# EAGLE design Cthulhu_Shield_Rev2f (EAGLE 9.2.2)
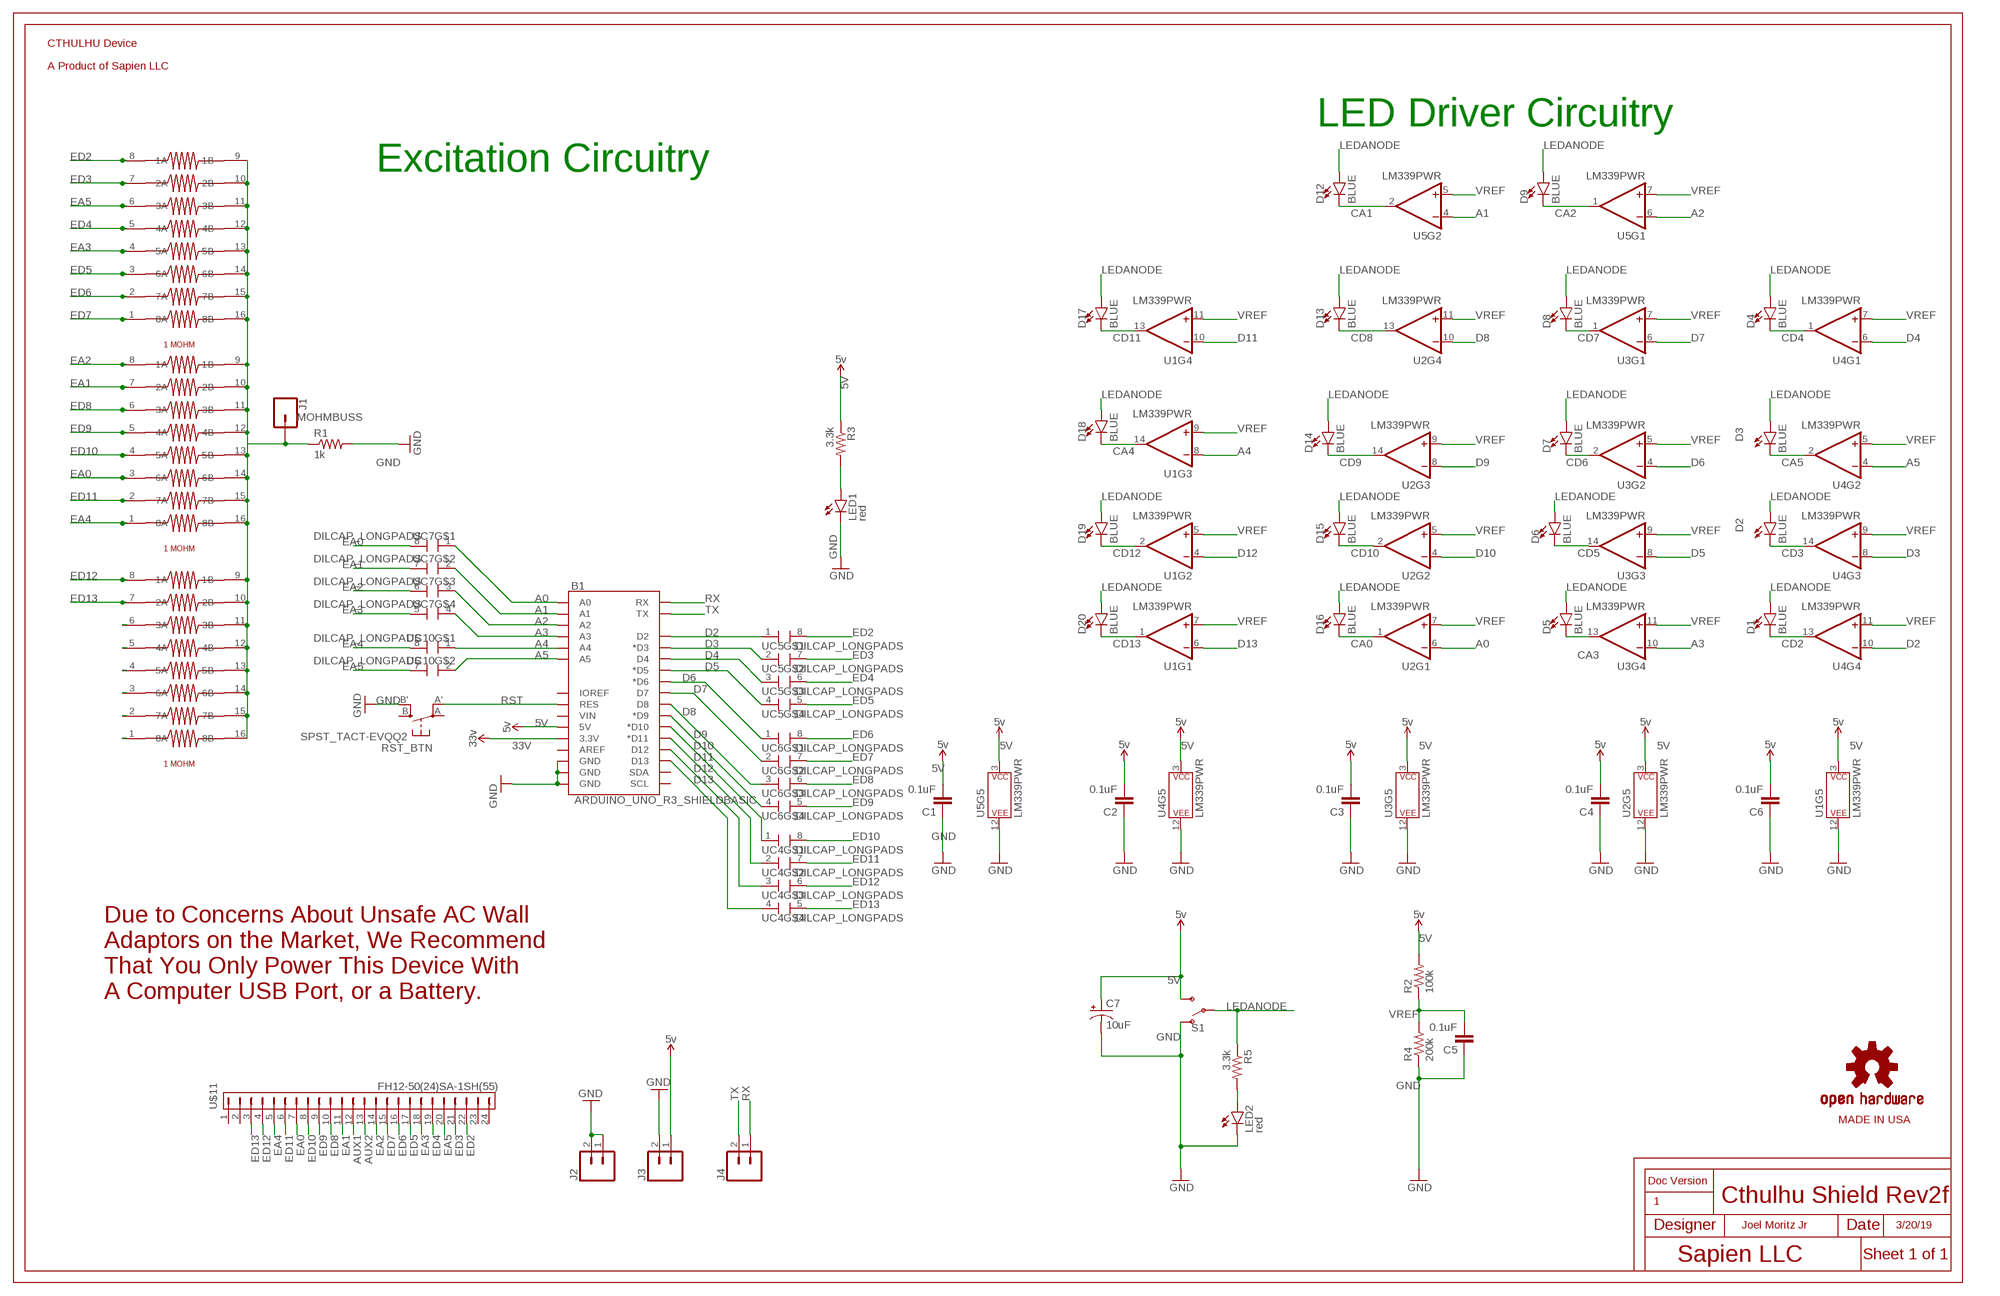
[diagram p0: schematic, sheet 1]

## Parts
B1  ARDUINO_UNO_R3_SHIELDBASIC  [UNO_R3_SHIELD]
C1  0.1uF  0.1UF-0603-25V-(+80/-20%)  [0603]
C2  0.1uF  0.1UF-0603-25V-(+80/-20%)  [0603]
C3  0.1uF  0.1UF-0603-25V-(+80/-20%)  [0603]
C4  0.1uF  0.1UF-0603-25V-(+80/-20%)  [0603]
C5  0.1uF  0.1UF-0603-25V-(+80/-20%)  [0603]
C6  0.1uF  0.1UF-0603-25V-(+80/-20%)  [0603]
C7  10uF  10UF-POLAR-EIA3528-20V-10%(TANT)  [EIA3528]
D1  BLUE  LED-BLUE0603  [LED-0603]
D2  BLUE  LED-BLUE0603  [LED-0603]
D3  BLUE  LED-BLUE0603  [LED-0603]
D4  BLUE  LED-BLUE0603  [LED-0603]
D5  BLUE  LED-BLUE0603  [LED-0603]
D6  BLUE  LED-BLUE0603  [LED-0603]
D7  BLUE  LED-BLUE0603  [LED-0603]
D8  BLUE  LED-BLUE0603  [LED-0603]
D9  BLUE  LED-BLUE0603  [LED-0603]
D12  BLUE  LED-BLUE0603  [LED-0603]
D13  BLUE  LED-BLUE0603  [LED-0603]
D14  BLUE  LED-BLUE0603  [LED-0603]
D15  BLUE  LED-BLUE0603  [LED-0603]
D16  BLUE  LED-BLUE0603  [LED-0603]
D17  BLUE  LED-BLUE0603  [LED-0603]
D18  BLUE  LED-BLUE0603  [LED-0603]
D19  BLUE  LED-BLUE0603  [LED-0603]
D20  BLUE  LED-BLUE0603  [LED-0603]
J1  CONN_01  [1X01]
J2  CONN_02  [1X02]
J3  CONN_02  [1X02]
J4  CONN_02  [1X02]
LED1  red  LED1206  [LED-1206]
LED2  red  LED1206  [LED-1206]
LOGO1  OSHW-LOGOL  [OSHW-LOGO-L]
R1  1k  RESISTOR0402  [0402]
R2  100k  RESISTOR0402  [0402]
R3  3.3k  RESISTOR0402  [0402]
R4  200k  RESISTOR0402  [0402]
R5  3.3k  RESISTOR0402  [0402]
RST_BTN  SPST_TACT-EVQQ2  [EVQ-Q2]
S1  SWITCH-SPDT-SMD-AYZ0202  [SWITCH_DPDT_SMD_AYZ0202]
U1  LM339PWR  LM339  [TSSOP-14]
U2  LM339PWR  LM339  [TSSOP-14]
U3  LM339PWR  LM339  [TSSOP-14]
U4  LM339PWR  LM339  [TSSOP-14]
U5  LM339PWR  LM339  [TSSOP-14]
U$1  1MOHM8  [JJ_CUSTOM_PARTS_1MOHMARRAY]
U$2  1MOHM8  [JJ_CUSTOM_PARTS_1MOHMARRAY]
U$3  1MOHM8  [JJ_CUSTOM_PARTS_1MOHMARRAY]
U$4  NO_WALL_ADAPTOR  [NO_WALL_ADAPTOR]
U$5  MADEINUSA  [MADEINUSA]
U$8  SAPEIN_LOGO_BOTTOM  [SAPIEN_LOGO_BOTTOM]
U$9  CTHULHU_LOGO  [CTHULHU]
U$11  FH12-50(24)SA-1SH(55)  [FH12-16S-1SH]
UC4  DILCAP_LONGPADS  [RESISTOR-DIL_4X0402ARV341_LONGPADS]
UC5  DILCAP_LONGPADS  [RESISTOR-DIL_4X0402ARV341_LONGPADS]
UC6  DILCAP_LONGPADS  [RESISTOR-DIL_4X0402ARV341_LONGPADS]
UC7  DILCAP_LONGPADS  [RESISTOR-DIL_4X0402ARV341_LONGPADS]
UC10  DILCAP_LONGPADS  [RESISTOR-DIL_4X0402ARV341_LONGPADS]

## Nets
5V: B1.5V C1.2 C2.2 C3.2 C4.2 C6.2 C7.A(+) J3.1 R2.2 R3.1 S1.3(S) U1.3(P$V+) U2.3(P$V+) U3.3(P$V+) U4.3(P$V+) U5.3(P$V+) ; supply symbol labelled 5v
33V: B1.3.3V ; supply symbol labelled 33v
A0: B1.A0 U2.6(-IN) UC7.1
A1: B1.A1 U5.4(-IN) UC7.2
A2: B1.A2 U5.6(-IN) UC7.3
A3: B1.A3 U3.10(-IN) UC7.4
A4: B1.A4 U1.8(-IN) UC10.1
A5: B1.A5 U4.4(-IN) UC10.2
AUX1: U$11.12
AUX2: U$11.13
CA0: D16.C U2.1(OUT)
CA1: D12.C U5.2(OUT)
CA2: D9.C U5.1(OUT)
CA3: D5.C U3.13(OUT)
CA4: D18.C U1.14(OUT)
CA5: D3.C U4.2(OUT)
CD2: D1.C U4.13(OUT)
CD3: D2.C U4.14(OUT)
CD4: D4.C U4.1(OUT)
CD5: D6.C U3.14(OUT)
CD6: D7.C U3.2(OUT)
CD7: D8.C U3.1(OUT)
CD8: D13.C U2.13(OUT)
CD9: D14.C U2.14(OUT)
CD10: D15.C U2.2(OUT)
CD11: D17.C U1.13(OUT)
CD12: D19.C U1.2(OUT)
CD13: D20.C U1.1(OUT)
D2: B1.D2 U4.10(-IN) UC5.1
D3: B1.D3(*D3) U4.8(-IN) UC5.2
D4: B1.D4 U4.6(-IN) UC5.3
D5: B1.D5(*D5) U3.8(-IN) UC5.4
D6: B1.D6(*D6) U3.4(-IN) UC6.1
D7: B1.D7 U3.6(-IN) UC6.2
D8: B1.D8 U2.10(-IN) UC6.3
D9: B1.D9(*D9) U2.8(-IN) UC6.4
D10: B1.D10(*D10) U2.4(-IN) UC4.1
D11: B1.D11(*D11) U1.10(-IN) UC4.2
D12: B1.D12 U1.4(-IN) UC4.3
D13: B1.D13 U1.6(-IN) UC4.4
EA0: U$2.3(6A) U$11.7 UC7.8
EA1: U$2.7(2A) U$11.11 UC7.7
EA2: U$2.8(1A) U$11.14 UC7.6
EA3: U$1.4(5A) U$11.18 UC7.5
EA4: U$2.1(8A) U$11.5 UC10.8
EA5: U$1.6(3A) U$11.20 UC10.7
ED2: U$1.8(1A) U$11.22 UC5.8
ED3: U$1.7(2A) U$11.21 UC5.7
ED4: U$1.5(4A) U$11.19 UC5.6
ED5: U$1.3(6A) U$11.17 UC5.5
ED6: U$1.2(7A) U$11.16 UC6.8
ED7: U$1.1(8A) U$11.15 UC6.7
ED8: U$2.6(3A) U$11.10 UC6.6
ED9: U$2.5(4A) U$11.9 UC6.5
ED10: U$2.4(5A) U$11.8 UC4.8
ED11: U$2.2(7A) U$11.6 UC4.7
ED12: U$3.8(1A) U$11.4 UC4.6
ED13: U$3.7(2A) U$11.3 UC4.5
GND: B1.GND@0(GND) B1.GND@1(GND) B1.GND@2(GND) C1.1 C2.1 C3.1 C4.1 C5.1 C6.1 C7.C(-) J2.1 J2.2 J3.2 LED1.C LED2.C R1.2 R4.1 RST_BTN.B'(S1) S1.1(O) U1.12(P$V-) U2.12(P$V-) U3.12(P$V-) U4.12(P$V-) U5.12(P$V-)
LEDANODE: D1.A D2.A D3.A D4.A D5.A D6.A D7.A D8.A D9.A D12.A D13.A D14.A D15.A D16.A D17.A D18.A D19.A D20.A R5.1 S1.2(P)
MOHMBUSS: J1.1 R1.1 U$1.9(1B) U$1.10(2B) U$1.11(3B) U$1.12(4B) U$1.13(5B) U$1.14(6B) U$1.15(7B) U$1.16(8B) U$2.9(1B) U$2.10(2B) U$2.11(3B) U$2.12(4B) U$2.13(5B) U$2.14(6B) U$2.15(7B) U$2.16(8B) U$3.9(1B) U$3.10(2B) U$3.11(3B) U$3.12(4B) U$3.13(5B) U$3.14(6B) U$3.15(7B) U$3.16(8B)
N$1: LED1.A R3.2
N$20: LED2.A R5.2
N$76: U$3.6(3A)
N$77: U$3.5(4A)
N$78: U$3.4(5A)
N$79: U$3.3(6A)
N$80: U$3.2(7A)
N$81: U$3.1(8A)
RST: B1.RES RST_BTN.A'(P1)
RX: B1.RX J4.1
TX: B1.TX J4.2
VREF: C5.2 R2.1 R4.2 U1.5(+IN) U1.7(+IN) U1.9(+IN) U1.11(+IN) U2.5(+IN) U2.7(+IN) U2.9(+IN) U2.11(+IN) U3.5(+IN) U3.7(+IN) U3.9(+IN) U3.11(+IN) U4.5(+IN) U4.7(+IN) U4.9(+IN) U4.11(+IN) U5.5(+IN) U5.7(+IN)
Unconnected: B1.AREF B1.IOREF B1.SCL B1.SDA B1.VIN RST_BTN.A(P) RST_BTN.B(S) U5.8(-IN) U5.9(+IN) U5.10(-IN) U5.11(+IN) U5.13(OUT) U5.14(OUT) U$11.1 U$11.2 U$11.23 U$11.24 UC10.3 UC10.4 UC10.5 UC10.6

## Notes on the sheet
- LED Driver Circuitry
- Excitation Circuitry
- Doc Version
- 1 | Cthulhu Shield Rev2f
- Designer | Joel Moritz Jr | Date | 3/20/19
- Sapien LLC | Sheet 1 of 1

## Library data of the parts
B1 = SparkFun-Boards:ARDUINO_UNO_R3_SHIELD: Arduino R3 Shield Footprint Shield form compatible with the Arduino Uno R3. SparkFun Products: MG2639 Cellular Shield <https://www.sparkfun.com/products/13120> MIDI Shield <https://www.sparkfun.com/products/12898> R3 Stackable Headers Kit <https://www.sparkfun.com/products/11417>
C1-C6 = SparkFun-Capacitors:0.1UF: 0.1µF ceramic capacitors A capacitor is a passive two-terminal electrical component used to store electrical energy temporarily in an electric field.; PROD_ID: CAP-00810
C7 = SparkFun-Capacitors:10UF-POLAR: 10.0µF polarized capacitors A capacitor is a passive two-terminal electrical component used to store electrical energy temporarily in an electric field.; PROD_ID: CAP-08063
D1-D9 D12-D20 = SparkFun-LED:LED-BLUE: Blue SMD LED Used in manufacturing of various products at SparkFun Packages: 0603 - SMD 0603 package [Product Link] <http://www.digikey.com/product-detail/en/SMLE12BC7TT86/511-1589-2-ND/1641808> 1206 - SMD1206 package [Product Link] <http://www.digikey.com/product-detail/en/lite-on-inc/LTST-C150TBKT/160-1643-1-ND/573584> SparkFun Products: ESP8266 Thing-Dev Board <https://www.sparkfun.com/products/13711> RedBoard <https://www.sparkfun.com/products/12757>; PROD_ID: DIO-08575
J1 = SparkFun-Connectors:CONN_01: Single connection point. Often used as Generic Header-pin footprint for 0.1 inch spaced/style header connections On any of the 0.1 inch spaced packages, you can populate with these: Break Away Headers - Straight <https://www.sparkfun.com/products/116> (PRT-00116) Break Away Male Headers - Right Angle <https://www.sparkfun.com/products/553> (PRT-00553) Female Headers <https://www.sparkfun.com/products/115> (PRT-00115) Break Away Headers - Machine Pin <https://www.sparkfun.com/products/117> (PRT-00117) Break Away Female Headers - Swiss Machine Pin <https://www.sparkfun.com/products/743> (PRT-00743) This device is also useful as a general connection point to wire up your design to another part of your project. Our various solder wires solder well into these plated through hole pads. Hook-Up Wire - Assortment (Stranded, 22 AWG) <https://www.sparkfun.com/products/11375> (PRT-11375) Hook-Up Wire - Assortment (Solid Core, 22 AWG) <https://www.sparkfun.com/products/11367> (PRT-11367) View the entire wire category on our website here <https://www.sparkfun.com/categories/141> Special notes: SMTSO-256-ET is a "flush mount" nut for a 4-40 screw. We mostly use this on specialty testbeds; it is a nice way to connect hardware to your PCB at an adjustable hieght. Also note, the SNAP packages are for using a snappable style connector. We sell a baggie of snaps and they are also used on two LilyPad designs: Snap Assortment - 30 pack (male and female) <https://www.sparkfun.com/products/11347> (DEV-11347) LilyPad Arduino SimpleSnap <https://www.sparkfun.com/products/10941> (DEV-10941) LilyPad SimpleSnap Protoboard <https://www.sparkfun.com/products/10940> (DEV-10940)
J2-J4 = SparkFun-Connectors:CONN_02: Multi connection point. Often used as Generic Header-pin footprint for 0.1 inch spaced/style header connections On any of the 0.1 inch spaced packages, you can populate with these: Break Away Headers - Straight <https://www.sparkfun.com/products/116> (PRT-00116) Break Away Male Headers - Right Angle <https://www.sparkfun.com/products/553> (PRT-00553) Female Headers <https://www.sparkfun.com/products/115> (PRT-00115) Break Away Headers - Machine Pin <https://www.sparkfun.com/products/117> (PRT-00117) Break Away Female Headers - Swiss Machine Pin <https://www.sparkfun.com/products/743> (PRT-00743) For SCREWTERMINALS and SPRING TERMINALS visit here: Screw Terimnals on SparkFun.com <https://www.sparkfun.com/search/results?term=Screw+Terminals> (5mm/3.5mm/2.54mm spacing) This device is also useful as a general connection point to wire up your design to another part of your project. Our various solder wires solder well into these plated through hole pads. Hook-Up Wire - Assortment (Stranded, 22 AWG) <https://www.sparkfun.com/products/11375> (PRT-11375) Hook-Up Wire - Assortment (Solid Core, 22 AWG) <https://www.sparkfun.com/products/11367> (PRT-11367) View the entire wire category on our website here <https://www.sparkfun.com/categories/141> Special notes: Molex polarized connector foot print use with: PRT-08233 with associated crimp pins and housings. 2.54_SCREWTERM for use with PRT-10571. 3.5mm Screw Terminal footprints for PRT-08084 5mm Screw Terminal footprints for use with PRT-08432
LED1 LED2 = SparkFun-LED:LED: LEDs Standard schematic elements and footprints for 5mm, 3mm, 1206, and 0603 sized LEDs. 5mm - Spark Fun Electronics SKU : COM-00529 (and others)
LOGO1 = SparkFun-Aesthetics:OSHW-LOGO: Open-Source Hardware (OSHW) Logo This logo indicates the piece of hardware it is found on incorporates a OSHW license and/or adheres to the definition of open source hardware found here: http://freedomdefined.org/OSHW
R1-R5 = SparkFun-Resistors:RESISTOR: Generic Resistor Package
RST_BTN = adafruit:SPST_TACT: SMT 6mm switch, EVQQ2 series http://www.ladyada.net/library/eagle
S1 = SparkFun-Switches:SWITCH-SPDT: Single Pole, Double Throw (SPDT) Switch Single-pole, double-throw (SPDT) switch. Variant Overview SMD-AYZ0202 Surface Mount DPDT Switch <https://www.sparkfun.com/products/597> (COM-00597) Used on e.g. LilyPad Arduino USB - ATmega32U4 Board <https://www.sparkfun.com/products/12049> PTH-11.6X4.0MM SPDT Mini Power Switch <https://www.sparkfun.com/products/102> (COM-00102) Used on e.g. SparkFun Simon Says - Through-Hole Soldering Kit <https://www.sparkfun.com/products/10547> (KIT-10547) PTH-11.6X4.0MM-KIT KIT version of SPDT Mini Power Switch - Simplifies soldering by removing tStop of switch pins - only one side can be soldered. PTH-11.6X4.0MM-LOCK LOCK version of SPDT Mini Power Switch - Offset pins hold switch in place for easier soldering. SMD-RIGHT-ANGLE Surface Mount Right Angle Switch <https://www.sparkfun.com/products/10860> (COM-10860) Used on e.g. SparkFun ESP8266 Thing <https://www.sparkfun.com/products/13231>; PROD_ID: SWCH-08179; SF_ID: COM-00597
U1-U5 = SparkFun-IC-Amplifiers:LM339: Quad Comparator - LM339PWR Based on information from the SLCS006N datasheet from TI (www.ti.com). Created by nick@scantool.net, 2008. Updated 2016. SparkFun Products SparkFun OBD-II UART <https://www.sparkfun.com/products/9555> (WIG-09555) SparkFun Car Diagnostics Kit <https://www.sparkfun.com/products/10769> (RTL-10769); PROD_ID: IC-09990
U$1-U$3 = Terra_4dot0_12_DIP_JJM_EB2_9-10-2018_rigid_a:1MOHM8
U$4 = Logos:NO_WALL_ADAPTOR
U$5 = Logos:MADEINUSA
U$8 = Logos:SAPEIN_LOGO_BOTTOM
U$9 = Logos:CTHULHU_LOGO
U$11 = con-hirose_modified:FH12-50(24)SA-1SH(55)
UC4-UC7 UC10 = Terra_4dot0_12_DIP_JJM_EB2_9-10-2018_rigid_a:DILCAP_LONGPADS

## Board
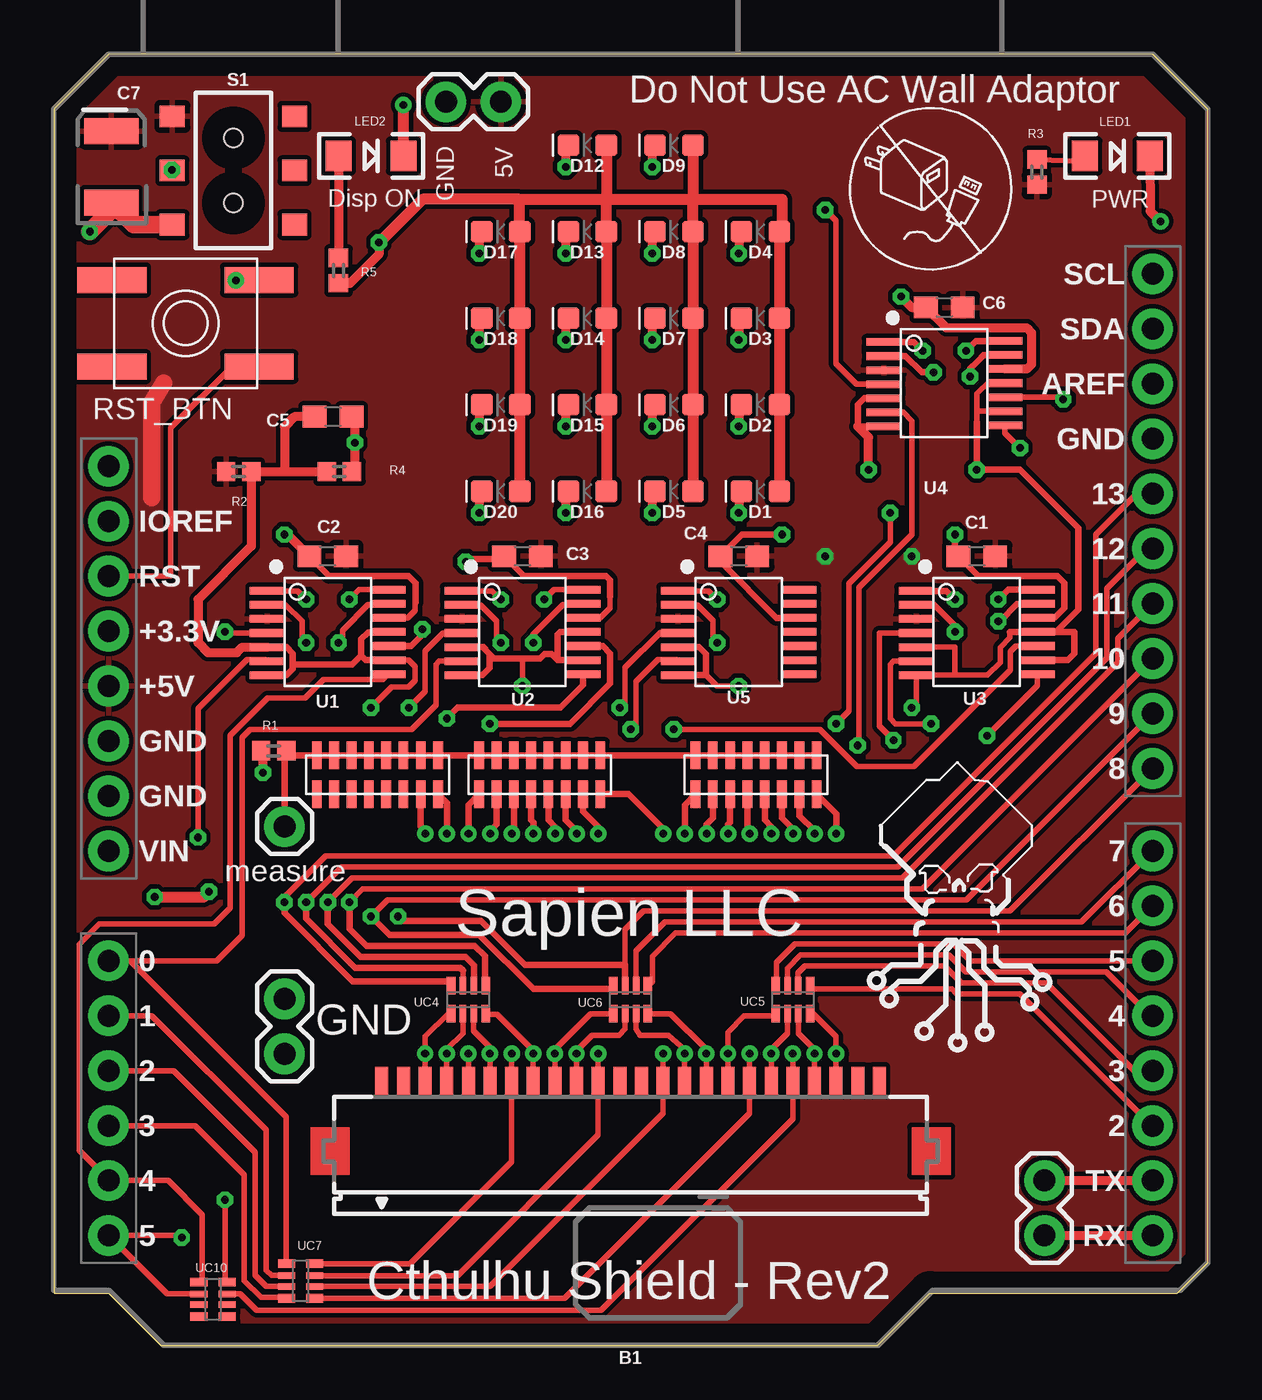
[diagram p1: board, top side]
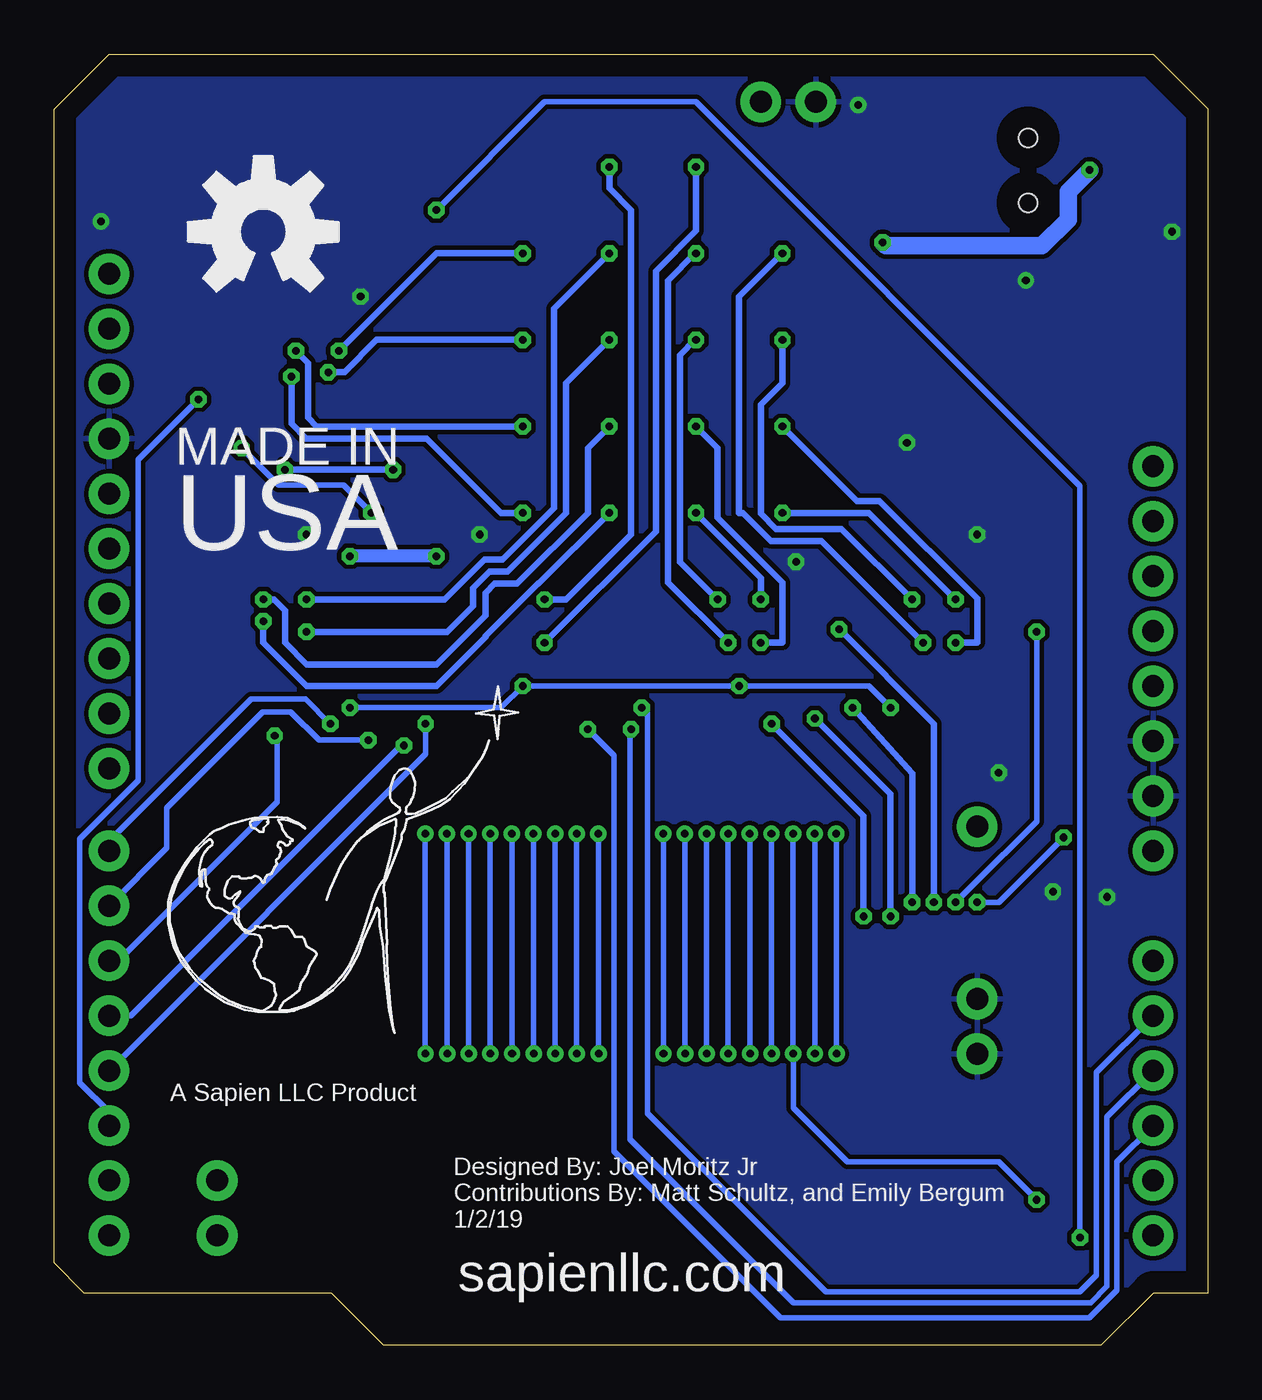
[diagram p2: board, bottom side, seen from below]

Size 53.32 x 59.69 mm. Coordinates in mm from the lower left corner, seen from the top.
Outline: 53.32,3.81 53.32,57.15 50.78,59.69 2.52,59.69 0,57.17 0,2.41 2.52,2.41 4.93,0 38.08,0 40.49,2.41 51.92,2.41 53.32,3.81
Copper layers (1*16): Top 0.035mm / dielectric 1.5mm / Bottom 0.035mm
Design rules "default *": minimum track width 6mil, minimum drill 0.35mm, track to track 8mil, track to pad 8mil, pad to pad 8mil, via to via 8mil, smd to smd 0mil, copper to edge 40mil, drill to drill 6mil, minimum pad ring 10mil, minimum via ring 8mil, stop-mask expansion 0mil, vias tented up to drill 15mil, thermal gap 10mil

### Footprints (pad centres in the part's own frame; a part is rotated, then mirrored left to right if it is on the bottom)
UNO_R3_SHIELD = drill 1.016 pad 1.88: 3.3V 24.13,-2.54; 5V 24.13,0; A0 24.13,12.7; A1 24.13,15.24; A2 24.13,17.78; A3 24.13,20.32; A4 24.13,22.86; A5 24.13,25.4; AREF -24.13,-13.97; D2 -24.13,20.32; D3 -24.13,17.78; D4 -24.13,15.24; D5 -24.13,12.7; D6 -24.13,10.16; D7 -24.13,7.62; D8 -24.13,3.81; D9 -24.13,1.27; D10 -24.13,-1.27; D11 -24.13,-3.81; D12 -24.13,-6.35; D13 -24.13,-8.89; GND@0 24.13,2.54; GND@1 24.13,5.08; GND@2 -24.13,-11.43; IOREF 24.13,-7.62; NC 24.13,-10.16; RES 24.13,-5.08; RX -24.13,25.4; SCL -24.13,-19.05; SDA -24.13,-16.51; TX -24.13,22.86; VIN 24.13,7.62
0603 = smd 1.1 x 1: 1 -0.85,0; 2 0.85,0
EIA3528 = smd 1.2 x 2.5: A 1.65,0; C -1.65,0
LED-0603 = smd 1 x 1: A -0.877,0; C 0.877,0
1X01 = drill 1.016 pad 1.88: 1 0,0
1X02 = drill 1.016 pad 1.88: 1 0,0; 2 2.54,0
LED-1206 = smd 1.2 x 1.4: A -1.5,0; C 1.5,0
0402 = smd 0.85 x 0.9: 1 -0.58,0; 2 0.58,0
EVQ-Q2 = smd 3.2 x 1.2: A -3.4,-2; A' 3.4,-2; B -3.4,2; B' 3.4,2
SWITCH_DPDT_SMD_AYZ0202 = smd 1 x 1.15: 1 -2.5,2.825; 2 0,2.825; 3 2.5,2.825; 4 -2.5,-2.825; 5 0,-2.825; 6 2.5,-2.825 | hole 0.85: 1.5,0; -1.5,0
TSSOP-14 = smd 1.6 x 0.35: 1 -2.8,1.9; 2 -2.8,1.25; 3 -2.8,0.6; 4 -2.8,-0.05; 5 -2.8,-0.7; 6 -2.8,-1.35; 7 -2.8,-2; 8 2.8,-1.95; 9 2.8,-1.3; 10 2.8,-0.65; 11 2.8,0; 12 2.8,0.65; 13 2.8,1.3; 14 2.8,1.95
JJ_CUSTOM_PARTS_1MOHMARRAY = smd 0.45 x 1.27: 1 0.5,0; 2 1.3,0; 3 2.1,0; 4 2.9,0; 5 3.7,0; 6 4.5,0; 7 5.3,0; 8 6.1,0; 9 0.5,1.8; 10 1.3,1.8; 11 2.1,1.8; 12 2.9,1.8; 13 3.7,1.8; 14 4.5,1.8; 15 5.3,1.8; 16 6.1,1.8
FH12-16S-1SH = smd 0.6 x 1.3: 1 -11.5,3.25; 2 -10.5,3.25; 3 -9.5,3.25; 4 -8.5,3.25; 5 -7.5,3.25; 6 -6.5,3.25; 7 -5.5,3.25; 8 -4.5,3.25; 9 -3.5,3.25; 10 -2.5,3.25; 11 -1.5,3.25; 12 -0.5,3.25; 13 0.5,3.25; 14 1.5,3.25; 15 2.5,3.25; 16 3.5,3.25; 17 4.5,3.25; 18 5.5,3.25; 19 6.5,3.25; 20 7.5,3.25; 21 8.5,3.25; 22 9.5,3.25; 23 10.5,3.25; 24 11.5,3.25
RESISTOR-DIL_4X0402ARV341_LONGPADS = smd 0.4 x 0.8: 1 -0.8,-0.648; 4 0.8,-0.648; 5 0.8,0.648; 8 -0.8,0.648 | smd 0.3 x 0.8: 2 -0.25,-0.648; 3 0.25,-0.648; 6 0.25,0.648; 7 -0.25,0.648

### Placement (x,y rotation side)
B1  26.65,30.48 180 top
C1  42.65,36.48 0 top
C2  12.65,36.48 0 top
C3  21.65,36.48 0 top
C4  31.65,36.48 0 top
C5  12.9,42.93 180 top
C6  41.15,47.98 0 top
C7  2.65,54.48 90 top
D1  32.65,39.48 180 top
D2  32.65,43.48 180 top
D3  32.65,47.48 180 top
D4  32.65,51.48 180 top
D5  28.65,39.48 180 top
D6  28.65,43.48 180 top
D7  28.65,47.48 180 top
D8  28.65,51.48 180 top
D9  28.65,55.48 180 top
D12  24.65,55.48 180 top
D13  24.65,51.48 180 top
D14  24.65,47.48 180 top
D15  24.65,43.48 180 top
D16  24.65,39.48 180 top
D17  20.65,51.48 180 top
D18  20.65,47.48 180 top
D19  20.65,43.48 180 top
D20  20.65,39.48 180 top
J1  10.65,23.98 0 top
J2  10.65,13.48 90 top
J3  20.65,57.48 180 top
J4  45.78,5.08 90 top
LED1  49.15,54.98 0 top
LED2  14.65,54.98 0 top
LOGO1  43.65,51.48 0 bottom
R1  10.15,27.48 180 top
R2  8.54,40.39 180 top
R3  45.43,54.23 90 top
R4  13.19,40.39 180 top
R5  13.15,49.68 90 top
RST_BTN  6.08,47.24 0 top
S1  8.29,54.31 90 top
U1  12.65,32.98 0 top
U2  21.65,32.98 0 top
U3  42.65,32.98 0 top
U4  41.15,44.48 0 top
U5  31.65,32.98 0 top
U$1  29.15,25.48 0 top
U$2  19.15,25.48 0 top
U$3  11.65,25.48 0 top
U$4  36.77,49.68 0 top
U$5  42.65,35.48 0 bottom
U$8  42.34,20.88 0 top
U$9  38.33,20.3 0 top
U$11  26.65,8.98 0 top
UC4  19.15,15.98 180 top
UC5  34.15,15.98 180 top
UC6  26.65,15.98 180 top
UC7  11.4,2.98 270 top
UC10  7.35,2.13 270 top

### Tracks (layer width: path | path; a pad name or v marks a point on that pad's centre or on a via)
5V  (via drill 0.35)
  Top 0.813: 5.07,44.47 4.51,43.58 4.51,39.18
  Bottom 0.61: v35.65,36.48 v39.65,36.48
  pour Top: -0.1,2.48 2.4,2.48 4.9,-0.02 38.15,-0.02 40.65,2.48 52.15,2.48 53.4,3.73 53.4,60.23 -0.1,60.23
A0
  Top 0.254: U2.6 17.8,31.63 17.65,31.48 17.65,29.61 16.52,28.48 9.06,28.48 8.69,28.11 8.69,18.95 7.52,17.78 B1.A0 3.52,17.78 10.74,10.57 10.74,3.8 UC7.1
A1  (via drill 0.35)
  Top 0.254: U5.4 28.82,32.96 28.03,32.96 26.4,31.34 26.4,29.73 v26.15,29.48 | UC7.2 10.05,3.23 9.8,3.48 9.8,9.96 4.52,15.24 B1.A1
  Bottom 0.254: B1.A1 5.15,12.61 5.15,3.23 5.9,2.48 17.65,2.48 25.9,10.73 25.9,29.23 v26.15,29.48
A2  (via drill 0.35)
  Top 0.254: UC7.3 9.81,2.72 9.29,3.24 9.29,8.93 5.52,12.7 B1.A2 | U5.6 28.77,31.71 27.93,31.71 26.9,30.69 26.9,28.73 v26.65,28.48 | UC7.3 | UC7.3 10.9,2.72
  Bottom 0.254: B1.A2 4.65,10.57 4.65,2.73 5.4,1.98 19.15,1.98 26.69,9.52 26.69,28.44 v26.65,28.48
A3  (via drill 0.35)
  Top 0.254: 10.79,2.21 9.57,2.21 8.78,3 8.78,7.9 6.52,10.16 B1.A3 | v28.65,28.48 35.4,28.48 37.11,26.77 39.74,26.77 44.2,31.23 44.2,32.08 44.45,32.33 U3.10 | UC7.4 10.79,2.21 | 10.79,2.21 10.87,2.21
  Bottom 0.254: B1.A3 4.19,8.49 4.19,2.54 5.46,1.27 19.74,1.27 27.44,8.97 27.44,27.27 v28.65,28.48
A4
  Top 0.254: U1.8 15.2,30.78 12.45,30.78 11.61,29.94 9.88,29.94 8.13,28.2 8.13,20.21 7.4,19.48 2.08,19.48 1.15,18.55 1.15,9.02 2.52,7.65 B1.A4 5.27,7.62 6.85,6.04 6.85,3.08 UC10.1
A5  (via drill 0.35)
  Top 0.254: v5.9,4.98 5.8,5.08 B1.A5 5.22,2.38 UC10.2 | v35.65,52.48 36.15,51.98 36.15,45.37 37.09,44.43 38.1,44.43
  Top 0.305: U4.4 38.1,44.43
  Bottom 0.254: v5.9,4.98 5.9,39.73 23.65,57.48 30.65,57.48 v35.65,52.48
CA0  (via drill 0.35)
  Top 0.254: U2.1 20.25,34.88 v20.65,34.48
  Top 0.406: D16.C 23.65,39.36 v23.65,38.48
  Bottom 0.305: v23.65,38.48 20.65,35.48 v20.65,34.48
CA1  (via drill 0.35)
  Top 0.254: v30.65,32.48 30.45,32.67 30.45,33.51 29.73,34.23 U5.2
  Top 0.406: D12.C 23.65,55.36 v23.65,54.48
  Bottom 0.305: v23.65,54.48 23.65,51.52 25.5,49.67 25.5,37.63 v30.65,32.48
CA2  (via drill 0.35)
  Top 0.254: U5.1 30.25,34.88 v30.65,34.48
  Top 0.406: D9.C 27.65,55.36 v27.65,54.48
  Bottom 0.305: v27.65,54.48 27.65,53.48 26.65,52.48 26.65,37.48 29.65,34.48 v30.65,34.48
CA3  (via drill 0.35)
  Top 0.305: U3.13 45.43,34.26 44.51,34.26 43.73,33.48 v43.65,33.48
  Top 0.406: D5.C 27.65,39.36 v27.65,38.48
  Bottom 0.305: v27.65,38.48 30.92,35.21 30.95,35.21 33.38,32.78 33.38,32.75 35.65,30.48 41.65,30.48 43.65,32.48 v43.65,33.48
CA4  (via drill 0.35)
  Top 0.254: U1.14 14.1,34.93 v13.65,34.48
  Top 0.406: D18.C 19.65,47.36 v19.65,46.48
  Bottom 0.305: v19.65,46.48 19.65,44.48 20.65,43.48 20.65,38.44 19.95,37.75 16.92,37.75 v13.65,34.48
CA5  (via drill 0.35)
  Top 0.305: U4.2 39.35,45.73 39.36,45.74 40.11,44.98 v40.65,44.98
  Top 0.406: D3.C 31.65,47.36 v31.65,46.48
  Bottom 0.305: v31.65,46.48 38.4,46.48 39.9,44.98 v40.65,44.98
CD2  (via drill 0.35)
  Top 0.305: U4.13 42.95,45.78 42.88,45.71 42.88,45.68 42.45,45.25 42.42,45.25 42.35,45.18 v42.35,44.78
  Top 0.406: D1.C 31.65,39.36 v31.65,38.48
  Bottom 0.305: v31.65,38.48 32.65,38.48 36.09,41.92 41.67,41.92 42.35,42.6 v42.35,44.78
CD3  (via drill 0.35)
  Top 0.305: U4.14 42.6,46.43 v42.15,45.98
  Top 0.406: D2.C 31.65,43.36 v31.65,42.48
  Bottom 0.305: v42.15,45.98 41.58,45.41 41.58,42.88 41.19,42.48 v31.65,42.48
CD4  (via drill 0.35)
  Top 0.305: U4.1 39.75,46.38 v40.15,45.98
  Top 0.406: D4.C 31.65,51.36 v31.65,50.48
  Bottom 0.305: v31.65,50.48 35.65,50.48 v40.15,45.98
CD5  (via drill 0.35)
  Top 0.305: U3.14 44.1,34.93 v43.65,34.48
  Top 0.406: D6.C 27.65,43.36 v27.65,42.48
  Bottom 0.305: v27.65,42.48 28.65,41.48 28.65,38.48 31.92,35.21 32.95,35.21 33.38,34.78 33.38,33.75 35.65,31.48 41.65,31.48 42.65,32.48 42.65,33.98 43.15,34.48 v43.65,34.48
CD6  (via drill 0.35)
  Top 0.305: v41.65,32.98 41.65,33.27 40.69,34.23 U3.2
  Top 0.406: D7.C 27.65,47.36 v27.65,46.48
  Bottom 0.305: v27.65,46.48 29.65,44.48 29.65,38.48 32.36,35.77 33.18,35.77 33.94,35.01 33.94,34.19 35.15,32.98 v41.65,32.98
CD7  (via drill 0.35)
  Top 0.305: U3.1 41.25,34.88 v41.65,34.48
  Top 0.406: D8.C 27.65,51.36 v27.65,50.48
  Bottom 0.305: v27.65,50.48 30.21,47.92 30.21,38.71 32.59,36.33 33.42,36.33 35.27,34.48 v41.65,34.48
CD8  (via drill 0.35)
  Top 0.254: U2.13 24.4,34.23 23.52,34.23 22.15,32.86 v22.15,32.48
  Top 0.406: D13.C 23.65,51.36 v23.65,50.48
  Bottom 0.305: v23.65,50.48 23.69,50.48 24.94,49.22 24.94,35.27 v22.15,32.48
CD9  (via drill 0.35)
  Top 0.254: U2.14 23.1,34.93 v22.65,34.48
  Top 0.406: D14.C 23.65,47.36 v23.65,46.48
  Bottom 0.305: v23.65,46.48 23.69,46.48 24.38,45.78 24.38,36.21 v22.65,34.48
CD10  (via drill 0.35)
  Top 0.254: v20.65,32.48 20.45,32.67 20.45,33.48 19.71,34.23 U2.2
  Top 0.406: D15.C 23.65,43.36 v23.65,42.48
  Bottom 0.305: v23.65,42.48 22.65,41.48 22.65,38.27 19.65,35.27 19.65,32.48 v20.65,32.48
CD11  (via drill 0.35)
  Top 0.254: U1.13 15.41,34.23 14.52,34.23 13.35,33.06 13.35,32.67 v13.15,32.48
  Top 0.406: D17.C 19.65,51.36 v19.65,50.48
  Bottom 0.305: v19.65,50.48 21.65,48.48 21.65,38.48 21.48,38.48 20.18,37.19 17.86,37.19 v13.15,32.48
CD12  (via drill 0.35)
  Top 0.254: v11.65,32.48 11.46,32.67 11.46,33.48 10.71,34.23 U1.2
  Top 0.406: D19.C 19.65,43.36 v19.65,42.48
  Bottom 0.305: v19.65,42.48 16.21,39.04 15.17,39.04 10.65,34.52 10.65,32.48 v11.65,32.48
CD13  (via drill 0.35)
  Top 0.254: U1.1 11.25,34.88 v11.65,34.48
  Top 0.406: D20.C 19.65,39.36 v19.65,38.48
  Bottom 0.305: v19.65,38.48 15.65,38.48 v11.65,34.48
D2  (via drill 0.35)
  Top 0.254: U4.10 46.55,43.83 v46.65,43.73 | B1.D2 50.75,10.16 44.65,16.26 41.72,16.26 41.49,16.48 35.1,16.48 UC5.1
  Bottom 0.254: B1.D2 50.78,10.79 52.12,12.13 52.12,23.41 49.43,26.1 49.43,40.95 v46.65,43.73
D3  (via drill 0.35)
  Top 0.254: UC5.2 34.39,17.22 34.71,17.54 41.15,17.54 41.93,16.76 45.87,16.76 49.93,12.7 B1.D3 | v36.15,28.73 36.74,29.32 36.74,35.21 38.65,37.13 v38.65,38.48 | v44.65,41.48 43.95,42.18 U4.8 | UC5.2 | UC5.2 34.39,16.49
  Bottom 0.254: v36.15,28.73 36.15,27.33 B1.D3 | v38.65,38.48 39.94,39.77 42.94,39.77 43.36,40.19 v44.65,41.48
D4  (via drill 0.35)
  Top 0.254: UC5.3 33.89,17.44 34.5,18.05 41.36,18.05 42.14,17.27 48.65,17.27 50.68,15.24 B1.D4 | v37.15,27.73 37.19,27.73 37.19,35.02 39.65,37.48 39.65,42.74 39.26,43.13 U4.6 | UC5.3 | UC5.3 33.89,16.48
  Bottom 0.254: B1.D4 49.78,15.24 37.29,27.73 v37.15,27.73
D5  (via drill 0.35)
  Top 0.254: 33.38,16.59 33.38,17.7 34.24,18.56 41.57,18.56 42.35,17.78 B1.D5 | v43.12,28.18 45.45,30.5 U3.8 | UC5.4 33.38,16.59 | 33.38,16.59 33.38,16.51
  Bottom 0.254: v43.12,28.18 43,28.05 43,25.13 50.35,17.78 B1.D5
D6  (via drill 0.35)
  Top 0.254: v38.8,27.98 38.15,28.63 38.15,32.93 U3.4 | B1.D6 49.52,19.06 28.73,19.06 27.66,17.99 27.66,16.84 UC6.1
  Bottom 0.254: v38.8,27.98 41.07,27.98 42.38,29.29 43.67,29.29 48.11,24.85 48.11,22.99 B1.D6
D7  (via drill 0.35)
  Top 0.254: U3.6 38.8,31.63 38.65,31.48 38.65,28.98 38.9,28.73 v40.55,28.73 | B1.D7 47.49,19.57 28.24,19.57 26.9,18.23 UC6.2
  Bottom 0.254: B1.D7 50.78,23.31 44.21,29.88 41.7,29.88 v40.55,28.73
D8  (via drill 0.35)
  Top 0.254: UC6.3 26.4,16.98 26.4,19.23 27.25,20.08 44.19,20.08 B1.D8
  Top 0.305: v15.9,19.83 15.96,19.61 19.74,19.61 21.77,17.58 26.4,17.58 26.4,16.98 | U2.10 25.37,32.33 25.7,31.99 25.7,30.59 23.84,28.73 v20.15,28.73
  Bottom 0.305: v15.9,19.83 15.9,24.48 v20.15,28.73
D9  (via drill 0.35)
  Top 0.254: v14.65,19.83 15.41,20.59 42.16,20.59 B1.D9 | UC6.4 25.7,16.48
  Top 0.305: v14.65,19.83 15.5,18.98 19.66,18.98 22.15,16.48 25.7,16.48 | v18.15,28.98 18.65,29.48 23.4,29.48 24.45,30.53 U2.8
  Bottom 0.305: v14.65,19.83 14.65,25.48 v18.15,28.98
D10  (via drill 0.35)
  Top 0.254: v13.65,20.48 14.27,21.1 40.13,21.1 B1.D10 | U2.4 17.97,32.93 17.15,32.1 17.15,30.23 v16.4,29.48 | UC4.1 19.92,16.59 19.92,16.51
  Top 0.305: v13.65,20.48 13.65,19.26 14.44,18.47 19.45,18.47 19.92,18 19.92,16.51
  Bottom 0.305: v16.4,29.48 13.65,26.43 v13.65,20.48
D11  (via drill 0.35)
  Top 0.254: v12.65,20.48 12.94,20.77 13.78,21.61 39.21,21.61 49.17,31.56 49.17,32.48 49.17,32.68 B1.D11 | UC4.2 19.41,16.48
  Top 0.305: v12.65,20.48 12.65,19.48 14.17,17.96 19.02,17.96 19.41,17.57 19.41,16.48 | U1.10 16.5,32.33 17.02,32.85 v17.02,33.1
  Bottom 0.305: v17.02,33.1 12.65,28.73 v12.65,20.48
D12  (via drill 0.35)
  Top 0.254: v11.65,20.48 11.94,20.77 13.28,22.11 39,22.11 48.66,31.77 48.66,34.99 50.5,36.83 B1.D12 | U1.4 7.95,32.93 v7.9,32.98 | 18.9,17.33 UC4.3
  Top 0.305: v11.65,20.48 11.65,19.73 13.93,17.46 18.77,17.46 | 18.77,17.46 | 18.77,17.46 18.9,17.33
  Bottom 0.254: v7.9,32.98 7.9,24.23 10.94,21.19 11.36,20.77 v11.65,20.48
D13  (via drill 0.35)
  Top 0.254: v10.65,20.48 10.65,20.73 12.54,22.62 38.79,22.62 48.15,31.98 48.15,37.48 50.04,39.37 B1.D13 | U1.6 9.77,31.71 8.93,31.71 6.65,29.44 v6.65,23.48 | UC4.4 18.35,16.83
  Top 0.305: v10.65,20.48 10.65,19.98 13.8,16.83 18.35,16.83
  Bottom 0.254: v6.65,23.48 9.65,20.48 v10.65,20.48
EA0  (via drill 0.35)
  Top 0.254: v21.15,13.48 U$11.7 21.15,8.48 16.45,3.78 UC7.8
  Top 0.305: v21.16,23.65 21.26,23.75 U$2.3
  Bottom 0.254: v21.16,23.65 v21.16,13.49 v21.15,13.48
EA1  (via drill 0.35)
  Top 0.254: v25.15,13.48 U$11.11 25.15,9.73 18.64,3.22 11.91,3.22 11.92,3.23 UC7.7
  Top 0.305: v25.16,23.65 25.16,23.97 24.45,24.68 U$2.7
  Bottom 0.254: v25.16,23.65 v25.16,13.49 v25.15,13.48
EA2  (via drill 0.35)
  Top 0.254: v28.15,13.48 U$11.14 28.15,10.73 20.15,2.73 UC7.6
  Top 0.305: v28.16,23.65 28.16,23.87 26.55,25.48 U$2.8
  Bottom 0.254: v28.16,23.65 v28.16,13.49 v28.15,13.48
EA3  (via drill 0.35)
  Top 0.254: v32.15,13.48 U$11.18 32.15,10.73 23.6,2.18 UC7.5
  Top 0.305: v32.16,23.65 32.06,23.75 U$1.4
  Bottom 0.254: v32.16,23.65 v32.16,13.49 v32.15,13.48
EA4  (via drill 0.35)
  Top 0.254: v19.15,13.48 U$11.5 | v7.9,6.73 7.9,3.03 UC10.8
  Top 0.305: v19.16,23.65 19.16,24.99 U$2.1
  Bottom 0.254: v19.16,23.65 v19.16,13.49 v19.15,13.48 19.15,10.98 16.65,8.48 9.65,8.48 v7.9,6.73
EA5  (via drill 0.35)
  Top 0.254: v34.15,13.48 U$11.20 34.15,10.48 25.29,1.62 9.35,1.62 8.6,2.38 UC10.7
  Top 0.305: v34.16,23.65 34.06,23.75 34.06,23.97 33.65,24.38 U$1.6
  Bottom 0.254: v34.16,23.65 v34.16,13.49 v34.15,13.48
ED2  (via drill 0.35)
  Top 0.254: U$11.22 v36.15,13.48 36.15,14.28 35.1,15.33 UC5.8
  Top 0.305: v36.16,23.65 36.16,24.57 U$1.8
  Bottom 0.254: v36.16,23.65 v36.16,13.49 v36.15,13.48
ED3  (via drill 0.35)
  Top 0.254: U$11.21 v35.15,13.48 35.15,13.68 34.4,14.43 UC5.7
  Top 0.305: v35.16,23.65 35.16,23.77 34.45,24.48 U$1.7
  Bottom 0.254: v35.16,23.65 v35.16,13.49 v35.15,13.48
ED4  (via drill 0.35)
  Top 0.254: U$11.19 v33.15,13.48 33.15,13.68 33.8,14.33 33.9,14.43 UC5.6
  Top 0.305: v33.16,23.65 33.16,23.97 32.85,24.28 U$1.5
  Bottom 0.254: v33.16,23.65 v33.16,13.49 v33.15,13.48
ED5  (via drill 0.35)
  Top 0.254: U$11.17 v31.15,13.48 31.15,14.48 31.9,15.23 33.25,15.23 UC5.5
  Top 0.305: v31.16,23.65 31.16,24.09 31.25,24.18 U$1.3
  Bottom 0.254: v31.16,23.65 v31.16,13.49 v31.15,13.48
ED6  (via drill 0.35)
  Top 0.254: U$11.16 v30.15,13.48 30.15,13.68 28.5,15.33 UC6.8
  Top 0.305: U$1.2 30.45,24.38 30.16,24.09 v30.16,23.65
  Bottom 0.254: v30.16,23.65 v30.16,13.49 v30.15,13.48
ED7  (via drill 0.35)
  Top 0.254: U$11.15 v29.15,13.48 29.15,13.68 28.39,14.34 27.09,14.34 26.9,14.63 UC6.7
  Top 0.305: U$1.1 29.16,24.99 v29.16,23.65
  Bottom 0.254: v29.16,23.65 v29.16,13.49 v29.15,13.48
ED8  (via drill 0.35)
  Top 0.254: U$11.10 v24.15,13.48 24.15,13.61 24.88,14.34 26.11,14.34 26.4,14.63 UC6.6
  Top 0.305: v24.16,23.65 24.16,23.77 23.65,24.28 U$2.6
  Bottom 0.254: v24.16,23.65 v24.16,13.49 v24.15,13.48
ED9  (via drill 0.35)
  Top 0.254: U$11.9 v23.15,13.48 23.15,13.68 24.8,15.33 UC6.5
  Top 0.305: U$2.5 22.85,24.28 23.16,23.97 v23.16,23.65
  Bottom 0.254: v23.16,23.65 v23.16,13.49 v23.15,13.48
ED10  (via drill 0.35)
  Top 0.254: U$11.8 v22.15,13.48 22.15,13.63 20.47,15.3 19.98,15.3 UC4.8
  Top 0.305: v22.16,23.65 22.16,24.17 22.05,24.28 U$2.4
  Bottom 0.254: v22.16,23.65 v22.16,13.49 v22.15,13.48
ED11  (via drill 0.35)
  Top 0.254: U$11.6 v20.15,13.48 20.15,13.78 19.4,14.53 UC4.7
  Top 0.305: v20.16,23.65 20.16,23.79 20.45,24.08 U$2.2
  Bottom 0.254: v20.16,23.65 v20.16,13.49 v20.15,13.48
ED12  (via drill 0.35)
  Top 0.254: U$11.4 v18.15,13.48 18.15,13.68 18.9,14.43 UC4.6
  Top 0.305: U$3.8 18.16,25.07 v18.16,23.65
  Bottom 0.254: v18.16,23.65 v18.16,13.49 v18.15,13.48
ED13  (via drill 0.35)
  Top 0.254: U$11.3 v17.15,13.48 17.15,14.28 18.2,15.33 UC4.5
  Top 0.305: v17.16,23.65 17.16,23.77 16.95,23.98 U$3.7
  Bottom 0.254: v17.16,23.65 v17.16,13.49 v17.15,13.48
GND  (via drill 0.35)
  Top 0.254: v8.4,49.23 8.41,49.24 RST_BTN.B' | 46.7,34.09 46.24,33.63 U3.12 | 25.21,33.63 U2.12 25.24,33.63 25.7,34.09 25.7,34.6 | 16.7,34.48 16.68,34.45 16.68,33.98 16.33,33.63 U1.12
  Top 0.305: v41.65,37.48 41.65,36.63 C1.1 42.72,35.56 46.39,35.56 46.7,35.24 46.7,34.09 | 16.7,34.34 16.7,34.48 16.7,35.24 16.39,35.56 12.72,35.56 C2.1 | v19.02,36.23 19.15,36.35 20.67,36.35 C3.1 21.72,35.56 25.51,35.56 25.7,35.37 25.7,34.6 | v33.65,37.48 31.8,37.48 C4.1 30.8,36.23 33.4,33.63 U5.12
  Top 0.406: v39.15,48.48 39.65,47.98 C6.1 41.24,47.04 44.95,47.04 45.18,46.81 45.18,45.35 44.96,45.13 U4.12 | v10.65,37.48 10.8,37.48 C2.1 | C5.1 13.9,42.78 v13.9,41.73 13.9,40.52 R4.1 | R1.2 9.65,27.4 v9.65,26.48 | LED1.C 50.67,52.44 v51.15,51.96
  Top 0.508: LED2.C v16.15,57.33 | v4.65,20.73 6.9,20.73 v7.15,20.98
  Top 0.813: S1.1 3.67,51.81 C7.C 2.65,52.48 v1.65,51.48
  pour Bottom: -0.1,2.48 2.4,2.48 4.9,-0.02 38.15,-0.02 40.65,2.48 52.15,2.48 53.4,3.73 53.4,57.23 50.9,59.73 2.4,59.73 -0.1,57.23
LEDANODE  (via drill 0.35)
  Top 0.406: v15.02,50.98 15.02,50.44 13.68,49.1 R5.1
  Top 0.508: v5.45,54.33 v5.45,54.32 S1.2 | D20.A D19.A D18.A D17.A 21.53,52.98 | D16.A D15.A D14.A D13.A 25.53,52.98 | D12.A 25.53,52.98 | D9.A 29.53,52.98 | D1.A D2.A D3.A D4.A 33.65,51.6 33.65,52.98 29.53,52.98 | D5.A D6.A D7.A D8.A 29.53,52.98 | 21.53,52.98 25.53,52.98 | 25.53,52.98 29.53,52.98 | 21.53,52.98 17.02,52.98 v15.02,50.98
  Bottom 0.813: v5.45,54.33 6.44,53.34 6.44,52.04 7.65,50.83 14.87,50.84 v15.02,50.98
MOHMBUSS
  Top 0.305: U$1.16 U$1.15 U$1.14 U$1.13 U$1.12 U$1.11 U$1.10 U$1.9 U$2.16 U$2.15 U$2.14 U$2.13 U$2.12 U$2.11 U$2.10 U$2.9 U$3.16 U$3.15 U$3.14 U$3.13 U$3.12 U$3.11 U$3.10 U$3.9 10.93,27.28 R1.1 10.65,27.4 J1.1
N$1
  Top 0.254: LED1.A 47.42,54.75 R3.2
N$20
  Top 0.406: LED2.A R5.2
RST
  Top 0.254: RST_BTN.A' 8.23,45.24 5.4,42.42 5.4,35.56 B1.RES
RX
  Top 0.406: J4.1 B1.RX
TX
  Top 0.406: J4.2 B1.TX
VREF  (via drill 0.35)
  Top 0.254: 42.65,43.23 42.65,43.99 43.22,44.56 43.87,44.56 U4.11 | 41.65,30.98 U3.7 39.85,29.68 v39.65,29.48 | 41.65,30.98 43.15,30.98 43.74,31.57 43.74,32.27 44.19,32.71 44.19,32.98 | U3.5 41.35,32.28 41.36,32.27 41.65,32.27 41.65,30.98 | v31.65,30.48 30.63,30.48 30.13,30.98 | v21.65,30.48 21.65,31.75 | v14.65,29.48 15.6,30.43 16.38,30.43 16.68,30.73 16.68,31.39 16.38,31.68 U1.9 | 42.65,43.23 42.65,42.67 | U4.9 42.7,43.18 42.65,43.23
  Top 0.305: U3.11 46.31,32.98 47.34,34.01 47.34,37.79 44.65,40.48 v42.65,40.48 42.65,42.67 | U3.11 47.15,32.98 47.15,31.98 46.85,31.68 U3.9 | 11.03,31.48 11.03,31.99 10.74,32.28 U1.5 | 11.03,31.48 11.03,31.27 10.74,30.98 U1.7 | U1.11 15.43,32.96 14.51,32.96 14.2,32.64 14.2,31.89 | 14.2,31.89 14.41,31.68 U1.9 | U2.5 19.85,32.28 19.92,32.21 19.92,32.18 20.13,31.96 | 20.13,31.96 20.13,31.31 19.8,30.98 U2.7 | U2.11 23.38,32.98 23.27,32.86 23.27,31.68 | 23.27,31.68 U2.9 | U5.5 29.81,32.28 30.13,31.96 30.13,30.98 U5.7 | U4.5 37.45,43.78 37.15,43.48 37.15,42.48 U4.7 | 11.03,31.48 13.78,31.48 14.2,31.89 | 23.27,31.68 22.99,31.96 22.67,31.96 22.45,31.75 21.65,31.75 20.35,31.75 20.13,31.96 | 44.19,32.98 U3.11
  Top 0.406: v37.65,40.48 37.65,41.98 37.15,42.48 | 10.65,40.39 R2.1 9.12,36.95 6.65,34.48 6.65,32.48 7.11,32.02 8.44,32.02 8.7,32.28 U1.5 | 10.65,40.39 R4.2 | C5.2 11.1,42.93 10.65,42.48 10.65,40.39
  Bottom 0.254: v39.65,29.48 32.65,29.48 v31.65,30.48 v21.65,30.48 15.65,30.48 v14.65,29.48
  Bottom 0.305: v37.65,40.48 v42.65,40.48

### Text on the board
tNames: Do Not Use AC Wall Adaptor | GND | 5V | PWR | Disp ON | measure | Sapien LLC | GND | Cthulhu Shield - Rev2
bNames: Designed By: Joel Moritz Jr / Contributions By: Matt Schultz, and Emily Bergum / 1/2/19 | sapienllc.com